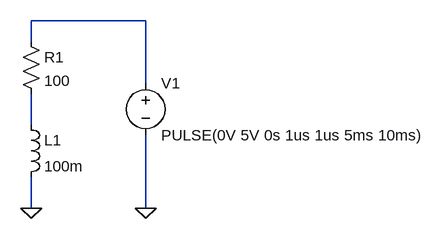
[diagram p0: schematic RL.asc]
RL.asc, the LTspice schematic file:
Version 4.1
SHEET 1 880 680
WIRE 256 32 80 32
WIRE 80 64 80 32
WIRE 256 128 256 32
WIRE 80 192 80 144
WIRE 80 320 80 272
WIRE 256 320 256 208
FLAG 80 320 0
FLAG 256 320 0
SYMBOL voltage 256 112 R0
WINDOW 123 0 0 Left 0
WINDOW 39 0 0 Left 0
SYMATTR InstName V1
SYMATTR Value PULSE(0V 5V 0s 1us 1us 5ms 10ms)
SYMBOL res 64 48 R0
SYMATTR InstName R1
SYMATTR Value 100
SYMBOL ind 64 176 R0
SYMATTR InstName L1
SYMATTR Value 100m

The netlist it stands for:
* RL.asc
V1 N001 0 PULSE(0V 5V 0s 1us 1us 5ms 10ms)
R1 N001 N002 100
L1 N002 0 100m
.backanno
.end